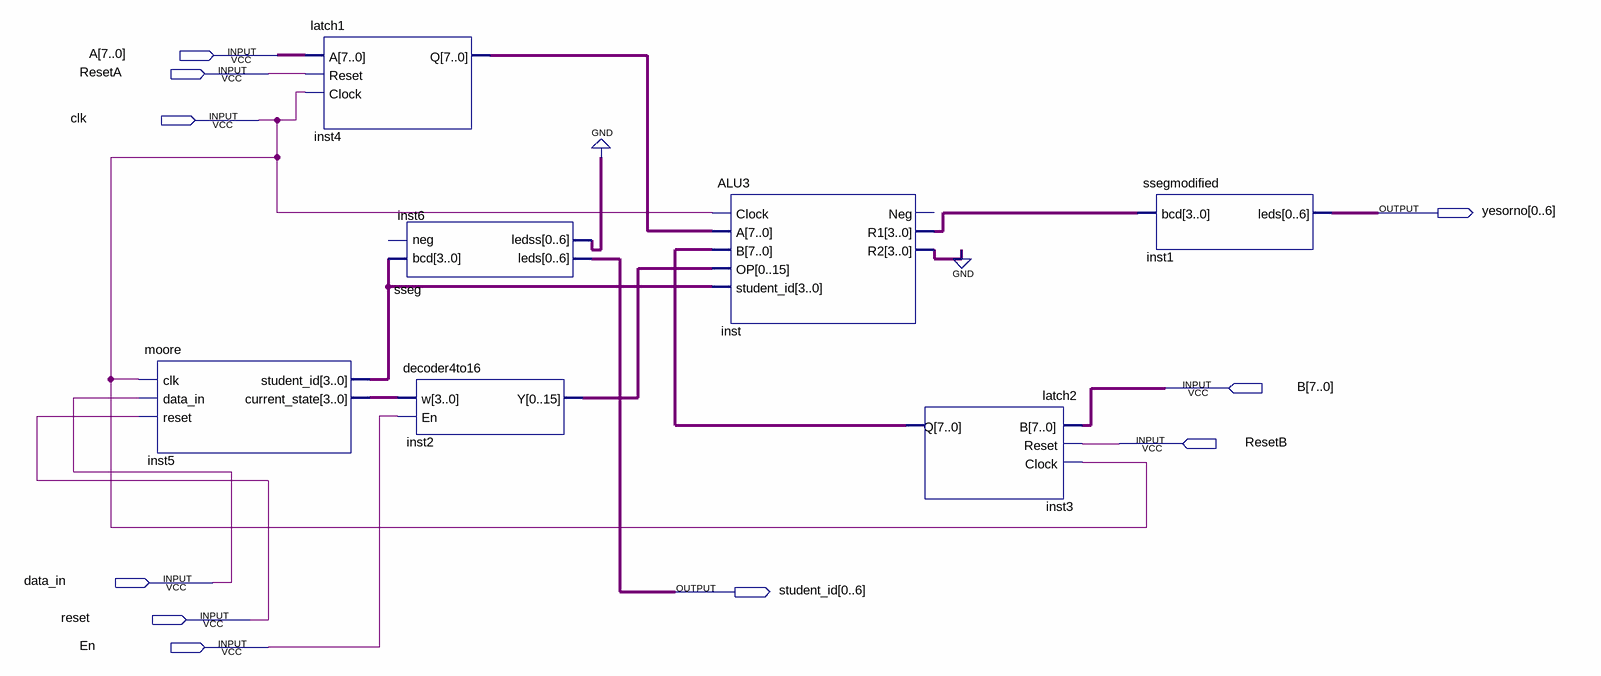
[diagram p0: schematic sheet]
// Quartus schematic ALU3block.bdf as structural Verilog: 7 symbols, 10 pins
module ALU3block (
  input  [7:0] A,
  input  ResetA,
  input  clk,
  input  [7:0] B,
  input  ResetB,
  input  data_in,
  input  reset,
  input  En,
  output [0:6] yesorno,
  output [0:6] student_id
);

  wire [3:0] inst5_current_state, inst5_student_id, inst_r1, inst_r2;
  wire [6:0] inst6_ledss;
  wire [7:0] inst3_q, inst4_q;
  wire [15:0] inst2_y;

  moore inst5 (
    .clk(clk), .data_in(data_in), .reset(reset), .student_id(inst5_student_id),
    .current_state(inst5_current_state));
  latch1 inst4 (.A(A), .Reset(ResetA), .Clock(clk), .Q(inst4_q));
  sseg inst6 (.bcd(inst5_student_id), .leds(student_id), .ledss(inst6_ledss));  // open: neg
  decoder4to16 inst2 (.w(inst5_current_state), .En(En), .Y(inst2_y));
  ALU3 inst (
    .Clock(clk), .A(inst4_q), .B(inst3_q), .OP(inst2_y), .student_id(inst5_student_id), .R1(inst_r1),
    .R2(inst_r2));  // open: Neg
  latch2 inst3 (.B(B), .Reset(ResetB), .Clock(clk), .Q(inst3_q));
  ssegmodified inst1 (.bcd(inst_r1), .leds(yesorno));
  // also tied to GND on the sheet: {inst6_ledss[0], inst6_ledss[1], inst6_ledss[2], inst6_ledss[3], inst6_ledss[4], inst6_ledss[5], inst6_ledss[6], inst_r2[0], inst_r2[1], inst_r2[2], inst_r2[3]}
endmodule
